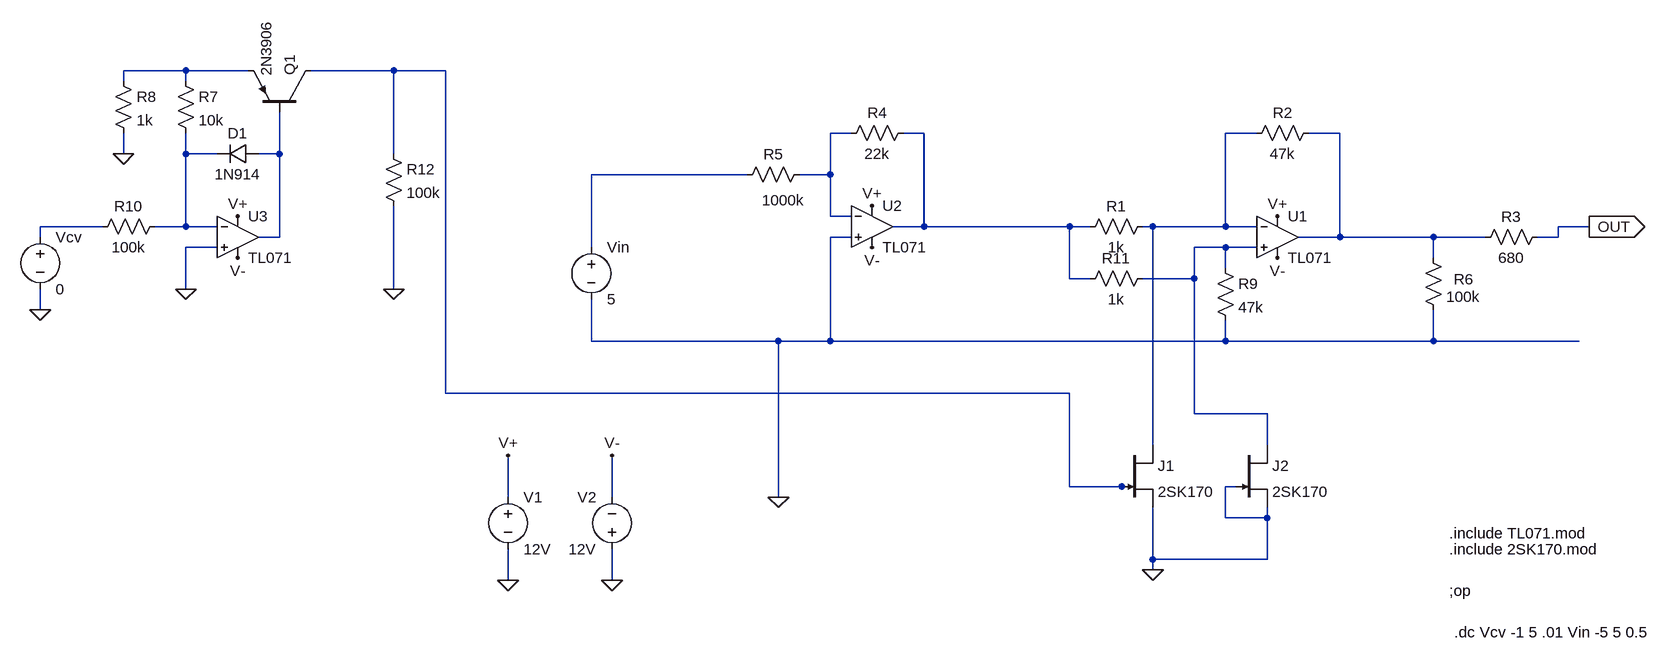
[diagram p0: schematic VCA-JFET.asc]
VCA-JFET.asc, the LTspice schematic file:
Version 4
SHEET 1 1144 848
WIRE -1360 -32 -1456 -32
WIRE -1264 -32 -1360 -32
WIRE -1040 -32 -1168 -32
WIRE -960 -32 -1040 -32
WIRE -1456 -16 -1456 -32
WIRE -1360 -16 -1360 -32
WIRE -336 64 -368 64
WIRE -224 64 -256 64
WIRE 288 64 240 64
WIRE 416 64 368 64
WIRE -1456 96 -1456 64
WIRE -1360 96 -1360 64
WIRE -1312 96 -1360 96
WIRE -1216 96 -1216 32
WIRE -1216 96 -1248 96
WIRE -1040 96 -1040 -32
WIRE -496 128 -736 128
WIRE -368 128 -368 64
WIRE -368 128 -416 128
WIRE -368 192 -368 128
WIRE -336 192 -368 192
WIRE -1488 208 -1584 208
WIRE -1360 208 -1360 96
WIRE -1360 208 -1408 208
WIRE -1312 208 -1360 208
WIRE -224 208 -224 64
WIRE -224 208 -272 208
WIRE 0 208 -224 208
WIRE 32 208 0 208
WIRE 128 208 112 208
WIRE 240 208 240 64
WIRE 240 208 128 208
WIRE 288 208 240 208
WIRE 800 208 752 208
WIRE -1584 224 -1584 208
WIRE -1216 224 -1216 96
WIRE -1216 224 -1248 224
WIRE -336 224 -368 224
WIRE 416 224 416 64
WIRE 416 224 352 224
WIRE 560 224 416 224
WIRE 640 224 560 224
WIRE 752 224 752 208
WIRE 752 224 720 224
WIRE -1312 240 -1360 240
WIRE -736 240 -736 128
WIRE 240 240 192 240
WIRE 288 240 240 240
WIRE 560 256 560 224
WIRE 240 272 240 240
WIRE 0 288 0 208
WIRE 32 288 0 288
WIRE 192 288 192 240
WIRE 192 288 112 288
WIRE -1360 304 -1360 240
WIRE -1040 304 -1040 176
WIRE -1584 336 -1584 304
WIRE -736 384 -736 320
WIRE -448 384 -736 384
WIRE -368 384 -368 224
WIRE -368 384 -448 384
WIRE 240 384 240 352
WIRE 240 384 -368 384
WIRE 560 384 560 336
WIRE 560 384 240 384
WIRE 784 384 560 384
WIRE -960 464 -960 -32
WIRE 0 464 -960 464
WIRE 192 496 192 288
WIRE 304 496 192 496
WIRE 128 544 128 208
WIRE 304 544 304 496
WIRE 0 608 0 464
WIRE 80 608 0 608
WIRE 96 608 80 608
WIRE 256 608 240 608
WIRE -864 624 -864 560
WIRE -704 624 -704 560
WIRE -448 624 -448 384
WIRE 240 656 240 608
WIRE 304 656 304 640
WIRE 304 656 240 656
WIRE 128 720 128 640
WIRE 304 720 304 656
WIRE 304 720 128 720
WIRE 128 736 128 720
WIRE -864 752 -864 704
WIRE -704 752 -704 704
FLAG -448 624 0
FLAG 800 208 OUT
IOPIN 800 208 Out
FLAG 128 736 0
FLAG -864 752 0
FLAG -704 752 0
FLAG -864 560 V+
FLAG -304 176 V+
FLAG 320 192 V+
FLAG -704 560 V-
FLAG -304 240 V-
FLAG 320 256 V-
FLAG -1280 192 V+
FLAG -1280 256 V-
FLAG -1360 304 0
FLAG -1456 96 0
FLAG -1584 336 0
FLAG -1040 304 0
DATAFLAG 752 208 ""
SYMBOL Opamps\\opamp2 320 160 R0
SYMATTR InstName U1
SYMATTR Value TL071
SYMBOL voltage -864 608 R0
SYMATTR InstName V1
SYMATTR Value 12V
SYMBOL voltage -704 720 R180
WINDOW 0 24 96 Left 2
WINDOW 3 24 16 Left 2
SYMATTR InstName V2
SYMATTR Value 12V
SYMBOL res 384 48 R90
WINDOW 0 0 56 VBottom 2
WINDOW 3 32 56 VTop 2
SYMATTR InstName R2
SYMATTR Value 47k
SYMBOL res 736 208 R90
WINDOW 0 0 56 VBottom 2
WINDOW 3 32 56 VTop 2
SYMATTR InstName R3
SYMATTR Value 680
SYMBOL Opamps\\opamp2 -304 144 R0
SYMATTR InstName U2
SYMATTR Value TL071
SYMBOL res 544 240 R0
WINDOW 0 47 49 Left 2
SYMATTR InstName R6
SYMATTR Value 100k
SYMBOL njf 80 544 R0
SYMATTR InstName J1
SYMATTR Value 2SK170
SYMBOL res 128 192 R90
WINDOW 0 0 56 VBottom 2
WINDOW 3 32 56 VTop 2
SYMATTR InstName R1
SYMATTR Value 1k
SYMBOL res -240 48 R90
WINDOW 0 0 56 VBottom 2
WINDOW 3 32 56 VTop 2
SYMATTR InstName R4
SYMATTR Value 22k
SYMBOL res -400 112 R90
WINDOW 0 0 56 VBottom 2
WINDOW 3 40 40 VTop 2
SYMATTR InstName R5
SYMATTR Value 1000k
SYMBOL voltage -736 224 R0
WINDOW 123 0 0 Left 2
WINDOW 39 0 0 Left 2
SYMATTR InstName Vin
SYMATTR Value 5
SYMBOL res 224 256 R0
SYMATTR InstName R9
SYMATTR Value 47k
SYMBOL res 128 272 R90
WINDOW 0 0 56 VBottom 2
WINDOW 3 32 56 VTop 2
SYMATTR InstName R11
SYMATTR Value 1k
SYMBOL njf 256 544 R0
SYMATTR InstName J2
SYMATTR Value 2SK170
SYMBOL Opamps\\opamp2 -1280 160 R0
SYMATTR InstName U3
SYMATTR Value TL071
SYMBOL diode -1248 80 R90
WINDOW 0 0 32 VBottom 2
WINDOW 3 32 32 VTop 2
SYMATTR InstName D1
SYMATTR Value 1N914
SYMBOL pnp -1168 32 M270
SYMATTR InstName Q1
SYMATTR Value 2N3906
SYMBOL res -1376 -32 R0
SYMATTR InstName R7
SYMATTR Value 10k
SYMBOL res -1472 -32 R0
SYMATTR InstName R8
SYMATTR Value 1k
SYMBOL res -1392 192 R90
WINDOW 0 0 56 VBottom 2
WINDOW 3 32 56 VTop 2
SYMATTR InstName R10
SYMATTR Value 100k
SYMBOL voltage -1584 208 R0
SYMATTR InstName Vcv
SYMATTR Value 0
SYMBOL res -1056 80 R0
SYMATTR InstName R12
SYMATTR Value 100k
TEXT 584 680 Left 2 !.include TL071.mod
TEXT 584 768 Left 2 !;op
TEXT 584 704 Left 2 !.include 2SK170.mod
TEXT 592 832 Left 2 !.dc Vcv -1 5 .01 Vin -5 5 0.5

The netlist it stands for:
* VCA-JFET.asc
XU1 N011 N005 V+ V- N006 TL071  ; pins In+ In- V+ V- OUT
V1 V+ 0 12V
V2 0 V- 12V
R2 N006 N005 47k
R3 OUT N006 680
XU2 0 N003 V+ V- N004 TL071  ; pins In+ In- V+ V- OUT
R6 N006 0 100k
J1 N005 N002 0 2SK170
R1 N005 N004 1k
R4 N004 N003 22k
R5 N003 N009 1000k
Vin N009 0 5
R9 N011 0 47k
R11 N011 N004 1k
J2 N011 0 0 2SK170
XU3 0 N007 V+ V- N008 TL071  ; pins In+ In- V+ V- OUT
D1 N008 N007 1N914
Q1 N002 N008 N001 0 2N3906
R7 N001 N007 10k
R8 N001 0 1k
R10 N007 N010 100k
Vcv N010 0 0
R12 N002 0 100k
.model D D
.lib standard.dio
.model NPN NPN
.model PNP PNP
.lib standard.bjt
.model NJF NJF
.model PJF PJF
.lib standard.jft
.include TL071.mod
;op
.include 2SK170.mod
.dc Vcv -1 5 .01 Vin -5 5 0.5
.backanno
.end